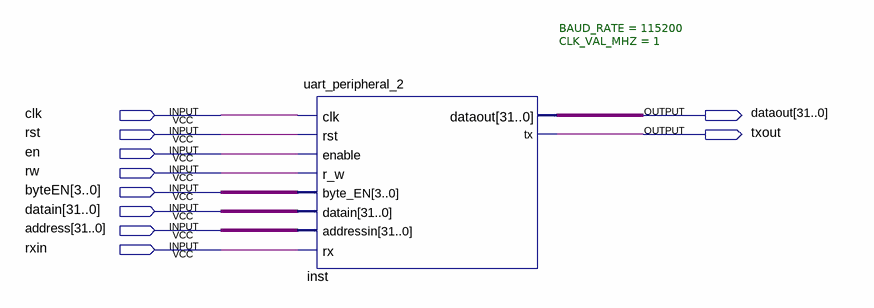
[diagram p0: schematic sheet]
// Quartus schematic uart_peripheral_2_test.bdf as structural Verilog: 1 symbols, 10 pins
module uart_peripheral_2_test (
  input  clk,
  input  rst,
  input  en,
  input  rw,
  input  [3:0] byteEN,
  input  [31:0] datain,
  input  [31:0] address,
  input  rxin,
  output [31:0] dataout,
  output txout
);

  uart_peripheral_2 #(.BAUD_RATE(115200), .CLK_VAL_MHZ(1)) inst (
    .clk(clk), .rst(rst), .enable(en), .r_w(rw), .byte_EN(byteEN), .datain(datain), .addressin(address),
    .rx(rxin), .dataout(dataout), .tx(txout));
endmodule
